# Altium project Super_Big.PrjPcb
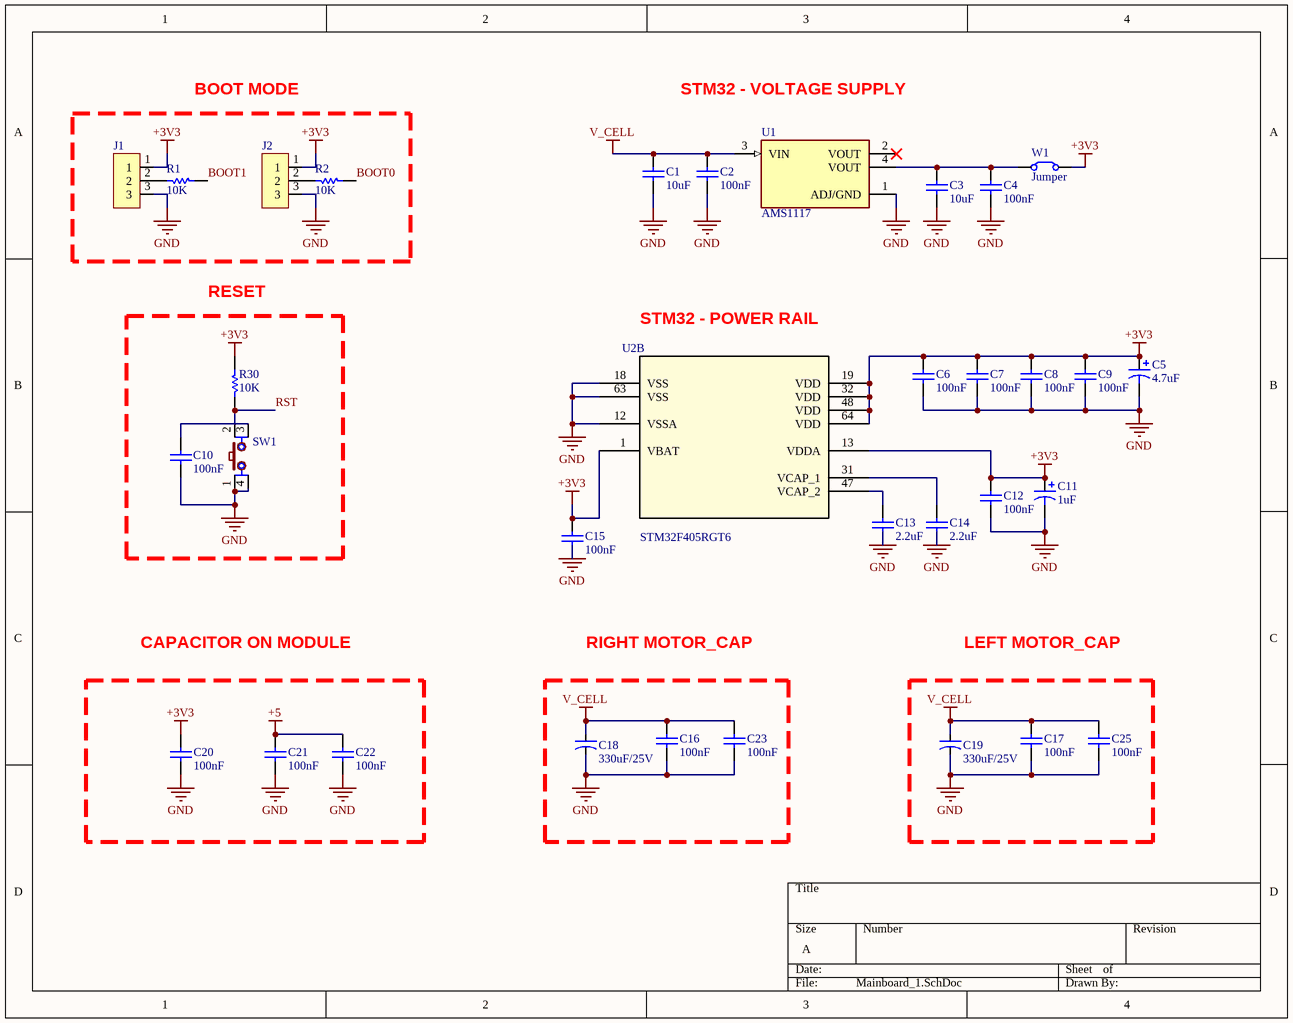
[diagram p0: Mainboard_1.SchDoc]
3 sheets, 104 parts. Net scope: global (net labels, ports and power ports of the same name join across sheets).
Board files: Mainboard.PcbDoc, PCB1.PcbDoc
Sheets:
  Mainboard_1.SchDoc
  Mainboard_2.SchDoc
  Nano_Power_Detection.SchDoc

## Sheet Mainboard_1.SchDoc
size A; SheetNumber: 1; SheetTotal: 3

### Parts
C1  10uF  [C1206]
C2  100nF  [6-0805_M]
C3  10uF  [C1206]
C4  100nF  [6-0805_M]
C5  4.7uF  [C1206]
C6  100nF  [6-0805_M]
C7  100nF  [6-0805_M]
C8  100nF  [6-0805_M]
C9  100nF  [6-0805_M]
C10  100nF  [6-0805_M]
C11  1uF  [C1206]
C12  100nF  [6-0805_M]
C13  2.2uF  [6-0805_M]
C14  2.2uF  [6-0805_M]
C15  100nF  [6-0805_M]
C16  100nF  [6-0805_M]
C17  100nF  [6-0805_M]
C18  330uF/25V  [CAP-ALU-SMD-F]
C19  330uF/25V  [CAP-ALU-SMD-F]
C20  100nF  [6-0805_M]
C21  100nF  [6-0805_M]
C22  100nF  [6-0805_M]
C23  100nF  [6-0805_M]
C25  100nF  [6-0805_M]
J1  3_pin connector  [3_PIN SERVO CONNECTOR]  (value not drawn)
J2  3_pin connector  [3_PIN SERVO CONNECTOR]  (value not drawn)
R1  10K  [6-0805_N]
R2  10K  [6-0805_N]
R30  10K  [6-0805_N]
SW1  SW  [SW2-SMD]  (value not drawn)
U1  AMS1117  [SOT229P700X180-4N]
U2  STM32F405RGT6  [LQFP64-10x10mm]  (part B of 2)
W1  Jumper  [Jumper]

### Blocks framed on the sheet
BOOT MODE: J1 J2 R1 R2
RESET: C10 R30 SW1

### Nets
+3V3: C5.1 C6.1 C7.1 C8.1 C9.1 C11.1 C12.1 C15.1 C20.1 J1.1 J2.1 R30.2 U2.1(VBAT) U2.13(VDDA) U2.19(VDD) U2.32(VDD) U2.48(VDD) U2.64(VDD) W1.2
+5: C21.1 C22.1
GND: C1.2 C2.2 C3.2 C4.2 C5.2 C6.2 C7.2 C8.2 C9.2 C10.2 C11.2 C12.2 C13.2 C14.2 C15.2 C16.2 C17.2 C18.2 C19.2 C20.2 C21.2 C22.2 C23.2 C25.2 J1.3 J2.3 SW1.1 SW1.4 U1.1(ADJ/GND) U2.12(VSSA) U2.18(VSS) U2.63(VSS)
V_CELL: C1.1 C2.1 C16.1 C17.1 C18.1 C19.1 C23.1 C25.1 U1.3(VIN)
BOOT0: R2.2
BOOT1: R1.2
RST: R30.1 SW1.3
NetC3_1: C3.1 C4.1 U1.4(VOUT) W1.1
NetC10_1: C10.1 SW1.2
NetC13_1: C13.1 U2.47(VCAP_2)
NetC14_1: C14.1 U2.31(VCAP_1)
NetJ1_2: J1.2 R1.1
NetJ2_2: J2.2 R2.1

Not connected (* = marked no-connect by the designer): U1 2(VOUT)*

### Notes on the sheet
- STM32 - VOLTAGE SUPPLY
- STM32 - POWER RAIL
- CAPACITOR ON MODULE
- RIGHT MOTOR_CAP
- LEFT MOTOR_CAP

### Library data of the parts
C1-C4 C6-C10 C12-C17 C20-C23 C25 = Cap: Capacitor; Published: 8-Jun-2000; LatestRevisionDate: 17-Jul-2002; LatestRevisionNote: Re-released for DXP Platform.; PackageReference: RAD-0.3; Publisher: Altium Limited; PackageDescription: Radial Cap, Thru-Hole; 2 Leads; 0.3 in Pin Spacing
C5 C11 = Cap Pol1: Polarized Capacitor (Radial); Published: 8-Jun-2000; LatestRevisionDate: 17-Jul-2002; LatestRevisionNote: Re-released for DXP Platform.; PackageReference: RB7.6-15; Publisher: Altium Limited; PackageDescription: Polarized Capacitor (Radial); 2 Leads
  C5: Value: 4.7uF
  C11: Value: 1uF
C18 C19 = CN-ALU-DIP: Capacitor (Semiconductor SIM Model); Value: 104; LatestRevisionDate: 17-Jul-2002; LatestRevisionNote: Re-released for DXP Platform.; PackageReference: C1206; Publisher: Altium Limited
J1 J2 = 3_pin connector: Boot using for stm32
R1 R2 R30 = Res1: Resistor; Published: 8-Jun-2000; LatestRevisionDate: 17-Jul-2002; LatestRevisionNote: Re-released for DXP Platform.; PackageReference: AXIAL-0.3; Publisher: Altium Limited; PackageDescription: Axial Device, Thru-Hole; 2 Leads; 0.3 in Pin Spacing; Value: 10K
SW1 = SW4: Switch button 4 pin; Value: Button chip 4 pin
U1 = AMS1117: 1A LOW DROPOUT VOLTAGE REGULATOR SOT-223; MF: Advanced Monolithic Systems; SnapEDA_Link: https://www.snapeda.com/parts/AMS1117/Advanced+Monolithic+Systems/view-part/?ref=snap; Package: SOT-223 Seeed Technology; Value: *; MP: AMS1117; Check_prices: https://www.snapeda.com/parts/AMS1117/Advanced+Monolithic+Systems/view-part/?ref=eda
U2 = STM32F405RGT6: High-performance foundation line, Arm Cortex-M4 core with DSP and FPU, 1 Mbyte of Flash memory, 168 MHz CPU, ART Accelerator; Manufacturer_Name: STMicroelectronics; Copyright: Copyright (C) 2025 Ultra Librarian. All rights reserved.; Manufacturer_Part_Number: STM32F405RGT6; Datasheet: https://www.st.com/resource/en/datasheet/stm32f405rg.pdf; RefDes: RefDes; Type: Type

## Sheet Mainboard_2.SchDoc
size A4; SheetNumber: 2; SheetTotal: 3
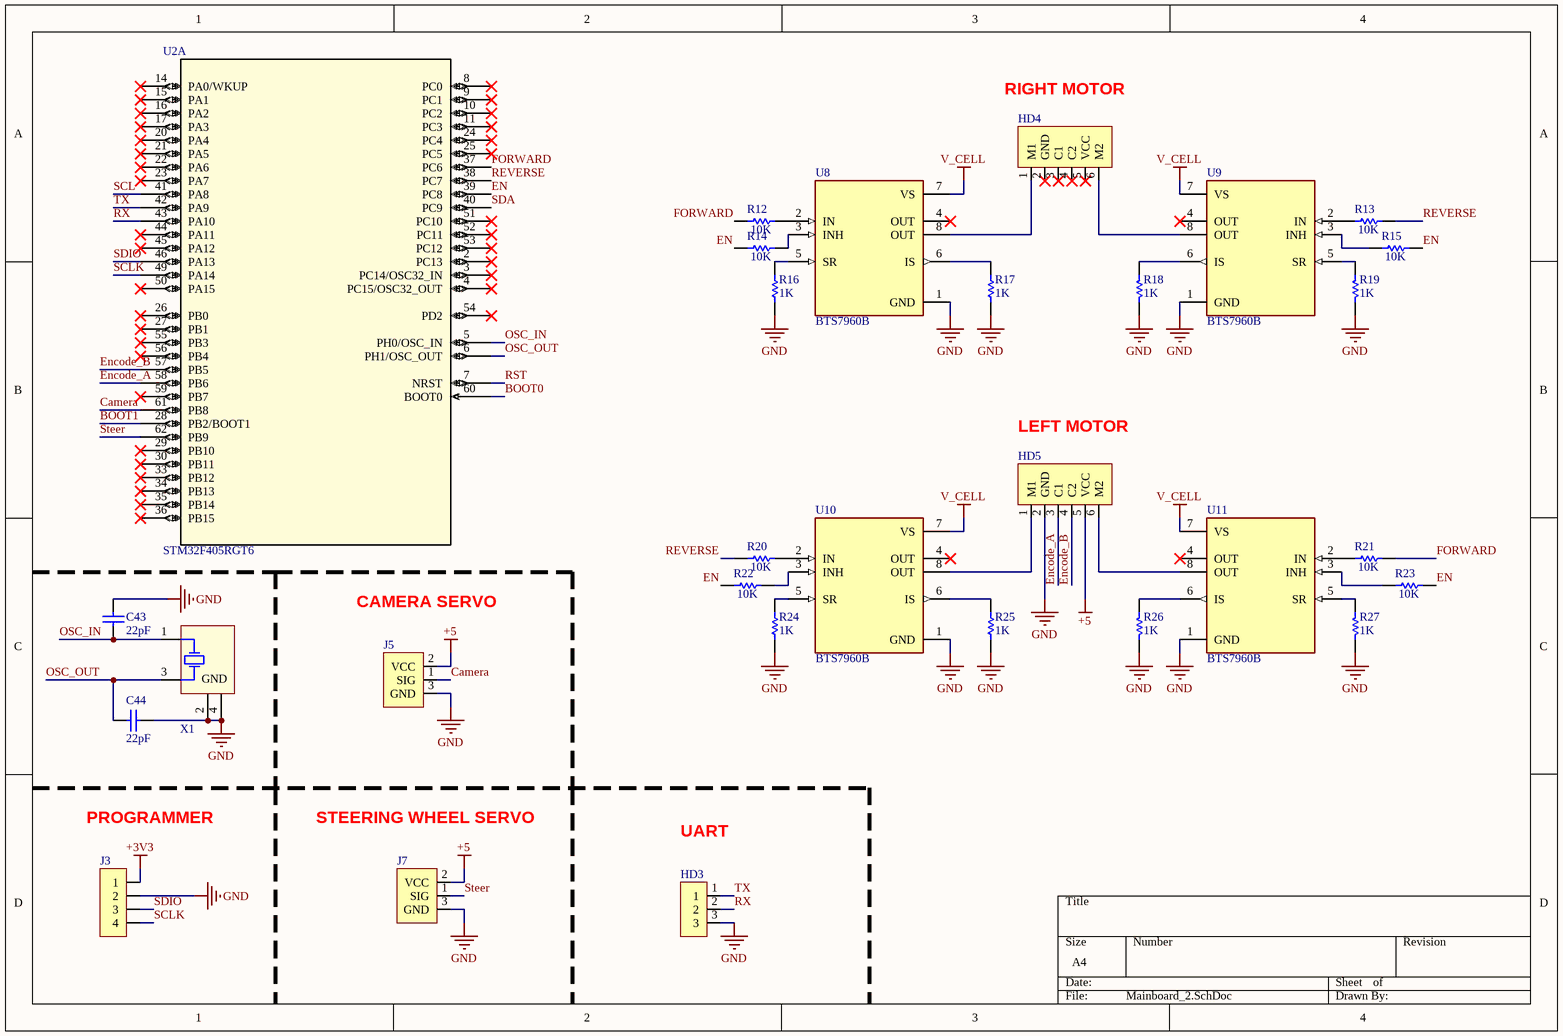
[diagram p1: Mainboard_2.SchDoc]

### Parts
C43  22pF  [6-0805_M]
C44  22pF  [6-0805_M]
HD3  3_pin conn  [3-pin XHB_2.54]  (value not drawn)
HD4  6-pin connnector (Encoder DC motor 2mm)  [6_PIN MOTOR]  (value not drawn)
HD5  6-pin connnector (Encoder DC motor 2mm)  [6_PIN MOTOR]  (value not drawn)
J3  4_pin connector  [4_PIN 2.54mm]  (value not drawn)
J5  3_pin steering wheel  [3_PIN SERVO CONNECTOR]  (value not drawn)
J7  3_pin steering wheel  [3_PIN SERVO CONNECTOR]  (value not drawn)
R12  10K  [6-0805_N]
R13  10K  [6-0805_N]
R14  10K  [6-0805_N]
R15  10K  [6-0805_N]
R16  1K  [6-0805_N]
R17  1K  [6-0805_N]
R18  1K  [6-0805_N]
R19  1K  [6-0805_N]
R20  10K  [6-0805_N]
R21  10K  [6-0805_N]
R22  10K  [6-0805_N]
R23  10K  [6-0805_N]
R24  1K  [6-0805_N]
R25  1K  [6-0805_N]
R26  1K  [6-0805_N]
R27  1K  [6-0805_N]
U2  STM32F405RGT6  [LQFP64-10x10mm]  (part A of 2)
U8  BTS7960B  [DPAK127P1490X440-8N]
U9  BTS7960B  [DPAK127P1490X440-8N]
U10  BTS7960B  [DPAK127P1490X440-8N]
U11  BTS7960B  [DPAK127P1490X440-8N]
X1  XT4  [XT4-SMD]  (value not drawn)

### Nets
+3V3: J3.1
+5: HD5.5(VCC) J5.2(VCC) J7.2(VCC)
GND: C43.1 C44.2 HD3.3 HD5.2(GND) J3.2 J5.3(GND) J7.3(GND) R16.2 R17.2 R18.2 R19.2 R24.2 R25.2 R26.2 R27.2 U8.1(GND) U9.1(GND) U10.1(GND) U11.1(GND) X1.2(GND) X1.4(GND)
V_CELL: U8.7(VS) U9.7(VS) U10.7(VS) U11.7(VS)
BOOT0: U2.60(BOOT0)
BOOT1: U2.28(PB2/BOOT1)
Camera: J5.1(SIG) U2.61(PB8)
EN: R14.1 R15.2 R22.1 R23.2 U2.39(PC8)
Encode_A: HD5.3(C1) U2.58(PB6)
Encode_B: HD5.4(C2) U2.57(PB5)
FORWARD: R12.1 R21.2 U2.37(PC6)
OSC_IN: C43.2 U2.5(PH0/OSC_IN) X1.1(XTAL)
OSC_OUT: C44.1 U2.6(PH1/OSC_OUT) X1.3(XTAL)
REVERSE: R13.2 R20.1 U2.38(PC7)
RST: U2.7(NRST)
RX: HD3.2 U2.43(PA10)
SCL: U2.41(PA8)
SCLK: J3.4 U2.49(PA14)
SDA: U2.40(PC9)
SDIO: J3.3 U2.46(PA13)
Steer: J7.1(SIG) U2.62(PB9)
TX: HD3.1 U2.42(PA9)
NetHD4_1: HD4.1(M1) U8.8(OUT)
NetHD4_6: HD4.6(M2) U9.8(OUT)
NetHD5_1: HD5.1(M1) U10.8(OUT)
NetHD5_6: HD5.6(M2) U11.8(OUT)
NetR12_2: R12.2 U8.2(IN)
NetR13_1: R13.1 U9.2(IN)
NetR14_2: R14.2 U8.3(INH)
NetR15_1: R15.1 U9.3(INH)
NetR16_1: R16.1 U8.5(SR)
NetR17_1: R17.1 U8.6(IS)
NetR18_1: R18.1 U9.6(IS)
NetR19_1: R19.1 U9.5(SR)
NetR20_2: R20.2 U10.2(IN)
NetR21_1: R21.1 U11.2(IN)
NetR22_2: R22.2 U10.3(INH)
NetR23_1: R23.1 U11.3(INH)
NetR24_1: R24.1 U10.5(SR)
NetR25_1: R25.1 U10.6(IS)
NetR26_1: R26.1 U11.6(IS)
NetR27_1: R27.1 U11.5(SR)

Not connected (* = marked no-connect by the designer): HD4 2(GND)* 3(C1)* 4(C2)* 5(VCC)*; U2 2(PC13)* 3(PC14/OSC32_IN)* 4(PC15/OSC32_OUT)* 8(PC0)* 9(PC1)* 10(PC2)* 11(PC3)* 14(PA0/WKUP)* 15(PA1)* 16(PA2)* 17(PA3)* 20(PA4)* 21(PA5)* 22(PA6)* 23(PA7)* 24(PC4)* 25(PC5)* 26(PB0)* 27(PB1)* 29(PB10)* 30(PB11)* 33(PB12)* 34(PB13)* 35(PB14)* 36(PB15)* 44(PA11)* 45(PA12)* 50(PA15)* 51(PC10)* 52(PC11)* 53(PC12)* 54(PD2)* 55(PB3)* 56(PB4)* 59(PB7)*; U8 4(OUT)*; U9 4(OUT)*; U10 4(OUT)*; U11 4(OUT)*

### Notes on the sheet
- RIGHT MOTOR
- LEFT MOTOR
- CAMERA SERVO
- PROGRAMMER
- STEERING WHEEL SERVO
- UART

### Library data of the parts
C43 C44 = Cap: Capacitor; Published: 8-Jun-2000; LatestRevisionDate: 17-Jul-2002; LatestRevisionNote: Re-released for DXP Platform.; PackageReference: RAD-0.3; Publisher: Altium Limited; PackageDescription: Radial Cap, Thru-Hole; 2 Leads; 0.3 in Pin Spacing
HD4 HD5 = 6-pin connnector (Encoder DC motor 2.54mm)
R12-R15 R20-R23 = Res1: Resistor; Published: 8-Jun-2000; LatestRevisionDate: 17-Jul-2002; LatestRevisionNote: Re-released for DXP Platform.; PackageReference: AXIAL-0.3; Publisher: Altium Limited; PackageDescription: Axial Device, Thru-Hole; 2 Leads; 0.3 in Pin Spacing; Value: 10K
R16-R19 R24-R27 = Res1: Resistor; Value: 10K; Published: 8-Jun-2000; LatestRevisionDate: 17-Jul-2002; LatestRevisionNote: Re-released for DXP Platform.; PackageReference: AXIAL-0.3; Publisher: Altium Limited; PackageDescription: Axial Device, Thru-Hole; 2 Leads; 0.3 in Pin Spacing
U2 = STM32F405RGT6: as U2 on sheet Mainboard_1; Copyright: Copyright (C) 2025 Ultra Librarian. All rights reserved.; Manufacturer_Part_Number: STM32F405RGT6; Datasheet: https://www.st.com/resource/en/datasheet/stm32f405rg.pdf; RefDes: RefDes; Type: Type
U8-U11 = BTS7960B: Half Bridge Driver DC Motors, General Purpose DMOS PG-TO263-7-1; MF: Infineon; SnapEDA_Link: https://www.snapeda.com/parts/BTS7960B/Infineon/view-part/?ref=snap; Package: TO-263 Infineon; Value: *; MP: BTS7960B; Check_prices: https://www.snapeda.com/parts/BTS7960B/Infineon/view-part/?ref=eda
X1 = XT4: Crystal, 16 MHz, -30 to 85 degC, 3.2 x 2.5 x 0.9 mm SMD; Value: 4Mhz

## Sheet Nano_Power_Detection.SchDoc
size A4; SheetNumber: 3; SheetTotal: 3
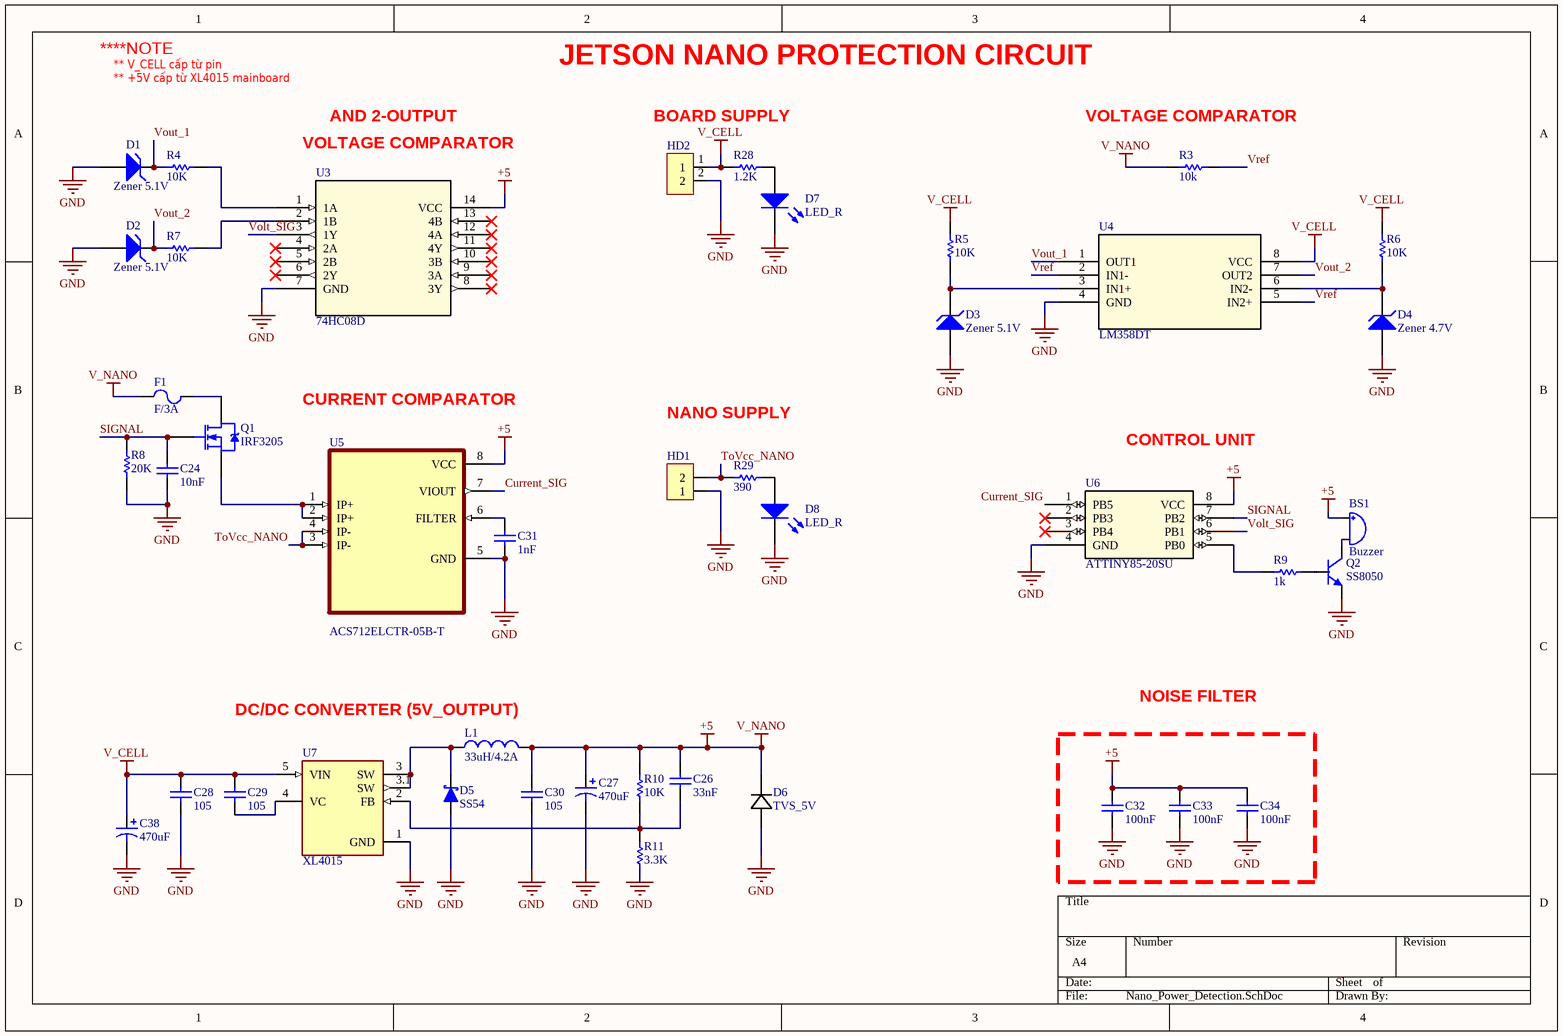
[diagram p2: Nano_Power_Detection.SchDoc]

### Parts
BS1  Buzzer  [Buzzer]
C24  10nF  [6-0805_M]
C26  33nF  [6-0805_M]
C27  470uF  [CAP-ALU-SMD-F]
C28  105  [C1206]
C29  105  [C1206]
C30  105  [C1206]
C31  1nF  [6-0805_M]
C32  100nF  [6-0805_M]
C33  100nF  [6-0805_M]
C34  100nF  [6-0805_M]
C38  470uF  [CAP-ALU-SMD-F]
D1  Zener 5.1V  [3.5X2.8X1.9]
D2  Zener 5.1V  [3.5X2.8X1.9]
D3  Zener 5.1V  [3.5X2.8X1.9]
D4  Zener 4.7V  [3.5X2.8X1.9]
D5  SS54  [DIOT_M5_025X220N]
D6  TVS_5V  [DIOT_M5_025X220N]
D7  LED_R  [6-0805_M]
D8  LED_R  [6-0805_M]
F1  F/3A  [FUSE (6.1 x 2.69 x 2.69mm) - duplicate]
HD1  Header2  [HDR2]  (value not drawn)
HD2  2_pin connector  [2_PIN POWER 3.96]  (value not drawn)
L1  33uH/4.2A  [IND_CDRH127/LDNP-470MC_SUM]
Q1  IRF3205  [TO-263]
Q2  SS8050  [SOT23_M]
R3  10k  [6-0805_N]
R4  10K  [6-0805_N]
R5  10K  [6-0805_N]
R6  10K  [6-0805_N]
R7  10K  [6-0805_N]
R8  20K  [6-0805_N]
R9  1k  [6-0805_N]
R10  10K  [6-0805_N]
R11  3.3K  [6-0805_N]
R28  1.2K  [C1206]
R29  390  [6-0805_N]
U3  74HC08D  [SO14_SOT108-1_NEX]
U4  LM358DT  [SOIC127P600X175-8N]
U5  ACS712ELCTR-05B-T  [SOIC127P600X175-8N]
U6  ATTINY85-20SU  [8S2_ATM]
U7  XL4015  [CONV_XL4015]

### Nets
+5: BS1.1 C26.2 C27.1 C30.2 C32.1 C33.1 C34.1 D6.1 F1.1 L1.2 R3.2 R10.1 U3.14(VCC) U5.8(VCC) U6.8(VCC)  [also labelled V_NANO]
GND: C24.2 C27.2 C28.1 C30.1 C31.2 C32.2 C33.2 C34.2 C38.2 D1.1(A) D2.1(A) D3.1(A) D4.1(A) D5.2(A) D6.2 D7.2(K) D8.2(K) HD1.1 HD2.2 Q2.2(E) R8.1 R11.2 U3.7(GND) U4.4(GND) U5.5(GND) U6.4(GND) U7.1(GND)
V_CELL: C28.2 C29.2 C38.1 HD2.1 R5.2 R6.2 R28.2 U4.8(VCC) U7.5(VIN)
Current_SIG: U5.7(VIOUT) U6.1(PB5)
SIGNAL: C24.1 Q1.1(G) R8.2 U6.7(PB2)
ToVcc_NANO: HD1.2 R29.2 U5.3(IP-) U5.4(IP-)
Volt_SIG: U3.3(1Y) U6.6(PB1)
Vout_1: D1.2(K) R4.2 U4.1(OUT1)
Vout_2: D2.2(K) R7.2 U4.7(OUT2)
Vref: R3.1 U4.2(IN1-) U4.5(IN2+)
NetBS1_2: BS1.2 Q2.1(C)
NetC26_1: C26.1 R10.2 R11.1 U7.2(FB)
NetC29_1: C29.1 U7.4(VC)
NetC31_1: C31.1 U5.6(FILTER)
NetD3_2: D3.2(K) R5.1 U4.3(IN1+)
NetD4_2: D4.2(K) R6.1 U4.6(IN2-)
NetD5_1: D5.1(K) L1.1 U7.3(SW) U7.3.1(SW)
NetD7_1: D7.1(A) R28.1
NetD8_1: D8.1(A) R29.1
NetF1_2: F1.2 Q1.2(D)
NetQ1_3: Q1.3(S) U5.1(IP+) U5.2(IP+)
NetQ2_3: Q2.3(B) R9.1
NetR4_1: R4.1 U3.1(1A)
NetR7_1: R7.1 U3.2(1B)
NetR9_2: R9.2 U6.5(PB0)

Not connected (* = marked no-connect by the designer): U3 4(2A)* 5(2B)* 6(2Y)* 8(3Y)* 9(3A)* 10(3B)* 11(4Y)* 12(4A)* 13(4B)*; U6 2(PB3)* 3(PB4)*

### Notes on the sheet
- ****NOTE
- ** V_CELL cấp từ pin
- ** +5V cấp từ XL4015 mainboard
- JETSON NANO PROTECTION CIRCUIT
- VOLTAGE COMPARATOR
- AND 2-OUTPUT
- BOARD SUPPLY
- (near R3) VOLTAGE COMPARATOR
- CURRENT COMPARATOR
- NANO SUPPLY
- CONTROL UNIT
- (near L1) DC/DC CONVERTER (5V_OUTPUT)
- NOISE FILTER

### Library data of the parts
C24 C26 C28-C34 = Cap: Capacitor; Published: 8-Jun-2000; LatestRevisionDate: 17-Jul-2002; LatestRevisionNote: Re-released for DXP Platform.; PackageReference: RAD-0.3; Publisher: Altium Limited; PackageDescription: Radial Cap, Thru-Hole; 2 Leads; 0.3 in Pin Spacing
C27 C38 = Cap Pol3: Polarized Capacitor (Surface Mount); Value: 680uF; Published: 8-Jun-2000; LatestRevisionDate: 29-May-2009; LatestRevisionNote: IPC-7351 Footprint Added.; PackageReference: C0805; Publisher: Altium Limited; PackageDescription: Chip Capacitor
D1-D4 = D Zener: Zener Diode; Published: 8-Jun-2000; LatestRevisionDate: 17-Jul-2002; LatestRevisionNote: Re-released for DXP Platform.; PackageReference: DIODE-0.7; Publisher: Altium Limited; PackageDescription: Diode, Thru-Hole; 2 Leads; 0.7 in Pin Spacing
D5 = SS54-HF: Diode Schottky 40 V 5A Surface Mount DO-214AC (SMA); MF: Comchip Technology; SnapEDA_Link: https://www.snapeda.com/parts/SS54-HF/Comchip/view-part/?ref=snap; Package: DO-214AC-214 Comchip Technology; Value: *; MP: SS54-HF; Check_prices: https://www.snapeda.com/parts/SS54-HF/Comchip/view-part/?ref=eda
D7 D8 = LED1: Typical RED GaAs LED; Published: 8-Jun-2000; LatestRevisionDate: 08-Jul-2005; LatestRevisionNote: Mech Layer 1 removed.; PackageReference: LED-1; Publisher: Altium Limited; PackageDescription: LED; 2 Leads
F1 = Fuse
HD1 = Header2: Header IDC, 2 x 1 Pin Vertical 2.54mm Pitch (Non-Boxed, Male); Manufacturer: W¨¹rth Elektronik eiSos GmbH; partNo: 613002143121; ComponentLink1 Description: Manufacturer; ComponentLink2 Description: Datasheet; NoPins: 02; Created Date: 29 March 2013; ComponentLink1URL: http://www.we-online.com; ComponentLink2URL: http://katalog.we-online.de/em/datasheet/6130xx143121.pdf; Created by: Karrer Zheng
L1 = Inductor: Code_IEC: 1005; Published: 8-Jun-2000; LatestRevisionDate: 29-May-2009; LatestRevisionNote: IPC-7351 Footprint Added.; PackageReference: 0402-A; Publisher: Altium Limited; PackageDescription: Chip Inductor; Code_JEITA: 0402
Q1 = IRFZ44: Value: IRF840
Q2 = SS8050: NPN General Purpose Amplifier; Published: 8-Jun-2000; LatestRevisionDate: 15-Jan-2003; LatestRevisionNote: PCB Footprint 'BCY-W3/D4.7' replaced; DatasheetVersion: 1997; PackageVersion: Sep-1998; PackageReference: TO-92A; Publisher: Altium Limited; PackageDescription: TO, Flat Index; 3 In-Line, Axial Leads; Body Dia. 4.5mm; Leads 0.51 x 0.48 mm (max); ComponentLink1Description: Manufacturer Link; ComponentLink1URL: http://www.fairchildsemi.com/; ComponentLink2Description: Datasheet; ComponentLink2URL: http://www.fairchildsemi.com/ds/2N%2F2N3904.pdf
R3 R5-R7 = Res1: Resistor; Published: 8-Jun-2000; LatestRevisionDate: 17-Jul-2002; LatestRevisionNote: Re-released for DXP Platform.; PackageReference: AXIAL-0.3; Publisher: Altium Limited; PackageDescription: Axial Device, Thru-Hole; 2 Leads; 0.3 in Pin Spacing; Value: 10K
R4 R10 R11 = Res1: Resistor; Value: 1.5k; Published: 8-Jun-2000; LatestRevisionDate: 17-Jul-2002; LatestRevisionNote: Re-released for DXP Platform.; PackageReference: AXIAL-0.3; Publisher: Altium Limited; PackageDescription: Axial Device, Thru-Hole; 2 Leads; 0.3 in Pin Spacing
R8 = Res1: Resistor; Value: 15K; Published: 8-Jun-2000; LatestRevisionDate: 17-Jul-2002; LatestRevisionNote: Re-released for DXP Platform.; PackageReference: AXIAL-0.3; Publisher: Altium Limited; PackageDescription: Axial Device, Thru-Hole; 2 Leads; 0.3 in Pin Spacing
R9 R28 R29 = Res1: Resistor; Value: 10K; Published: 8-Jun-2000; LatestRevisionDate: 17-Jul-2002; LatestRevisionNote: Re-released for DXP Platform.; PackageReference: AXIAL-0.3; Publisher: Altium Limited; PackageDescription: Axial Device, Thru-Hole; 2 Leads; 0.3 in Pin Spacing
U5 = ACS712ELCTR-05B-T: Current Sensor 5A 1 Channel Hall Effect, Open Loop Bidirectional 8-SOIC (0.154, 3.90mm Width); MF: Allegro; SnapEDA_Link: https://www.snapeda.com/parts/ACS712ELCTR-05B-T/Allegro/view-part/?ref=snap; Package: SOIC-8 Allegro MicroSystems LLC; Value: *; MP: ACS712ELCTR-05B-T; Check_prices: https://www.snapeda.com/parts/ACS712ELCTR-05B-T/Allegro/view-part/?ref=eda
U7 = XL4015: 5A 180KHz 36V Buck DC to DC Converter; MF: XLSEMI; SnapEDA_Link: https://www.snapeda.com/parts/XL4015/XLSEMI/view-part/?ref=snap; Package: None; Value: *; MP: XL4015; Check_prices: https://www.snapeda.com/parts/XL4015/XLSEMI/view-part/?ref=eda

## Nets that join several sheets
+3V3: Mainboard_1 (19 pins), Mainboard_2 (J3.1)
+5: Mainboard_1 (C21.1 C22.1), Mainboard_2 (HD5.5 J5.2 J7.2), Nano_Power_Detection (15 pins)
GND: Mainboard_1 (32 pins), Mainboard_2 (21 pins), Nano_Power_Detection (27 pins)
V_CELL: Mainboard_1 (9 pins), Mainboard_2 (U8.7 U9.7 U10.7 U11.7), Nano_Power_Detection (9 pins)
BOOT0: Mainboard_1 (R2.2), Mainboard_2 (U2.60)
BOOT1: Mainboard_1 (R1.2), Mainboard_2 (U2.28)
RST: Mainboard_1 (R30.1 SW1.3), Mainboard_2 (U2.7)